# Altium project DistanceMeasure.PrjPcb
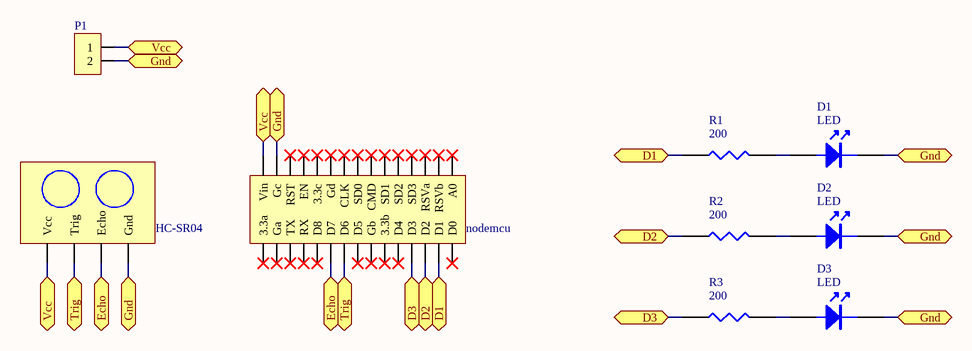
[diagram p0: DistanceMeasure.SchDoc]
1 sheet, 9 parts. Net scope: flat (ports and power ports of the same name join across sheets).
Board file: DistanceMeasure.PcbDoc

## Sheet DistanceMeasure.SchDoc
size A4

### Parts
D1  LED  [DIODE4MMUP]
D2  LED  [DIODE4MMUP]
D3  LED  [DIODE4MMUP]
HC-SR04  HC-SR04  [HC-SR04]  (value not drawn)
nodemcu  nodemcu  [nodemcu]  (value not drawn)
P1  LittleGreenMos  [LittleGreenMos]  (value not drawn)
R1  200  [RES0.4]
R2  200  [RES0.4]
R3  200  [RES0.4]

### Ports
D1, D2, D3, Echo, Gnd, Trig, Vcc

### Nets
NetD1_A: D1.A R1.2
NetD1_K: D1.K D2.K D3.K HC-SR04.Gnd nodemcu.Gc P1.2 ; port Gnd
NetD2_A: D2.A R2.2
NetD3_A: D3.A R3.2
NetHC-SR04_Echo: HC-SR04.Echo nodemcu.D7 ; port Echo
NetHC-SR04_Trig: HC-SR04.Trig nodemcu.D6 ; port Trig
NetHC-SR04_Vcc: HC-SR04.Vcc nodemcu.Vin P1.1 ; port Vcc
Netnodemcu_D1: nodemcu.D1 R1.1 ; port D1
Netnodemcu_D2: nodemcu.D2 R2.1 ; port D2
Netnodemcu_D3: nodemcu.D3 R3.1 ; port D3

Not connected (* = marked no-connect by the designer): nodemcu 3.3a* 3.3b* 3.3c* A0* CLK* CMD* D0* D4* D5* D8* EN* Ga* Gb* Gd* RST* RSVb(RSVa)* RX* SD0* SD1* SD2* SD3* TX*

### Library data of the parts
D1-D3 = LED: pin to pad: A>P K>N
R1-R3 = RES1